# Altium schematic sheet WIZARD_Control.SchDoc
size Letter; SheetNumber: 2; SheetTotal: 2
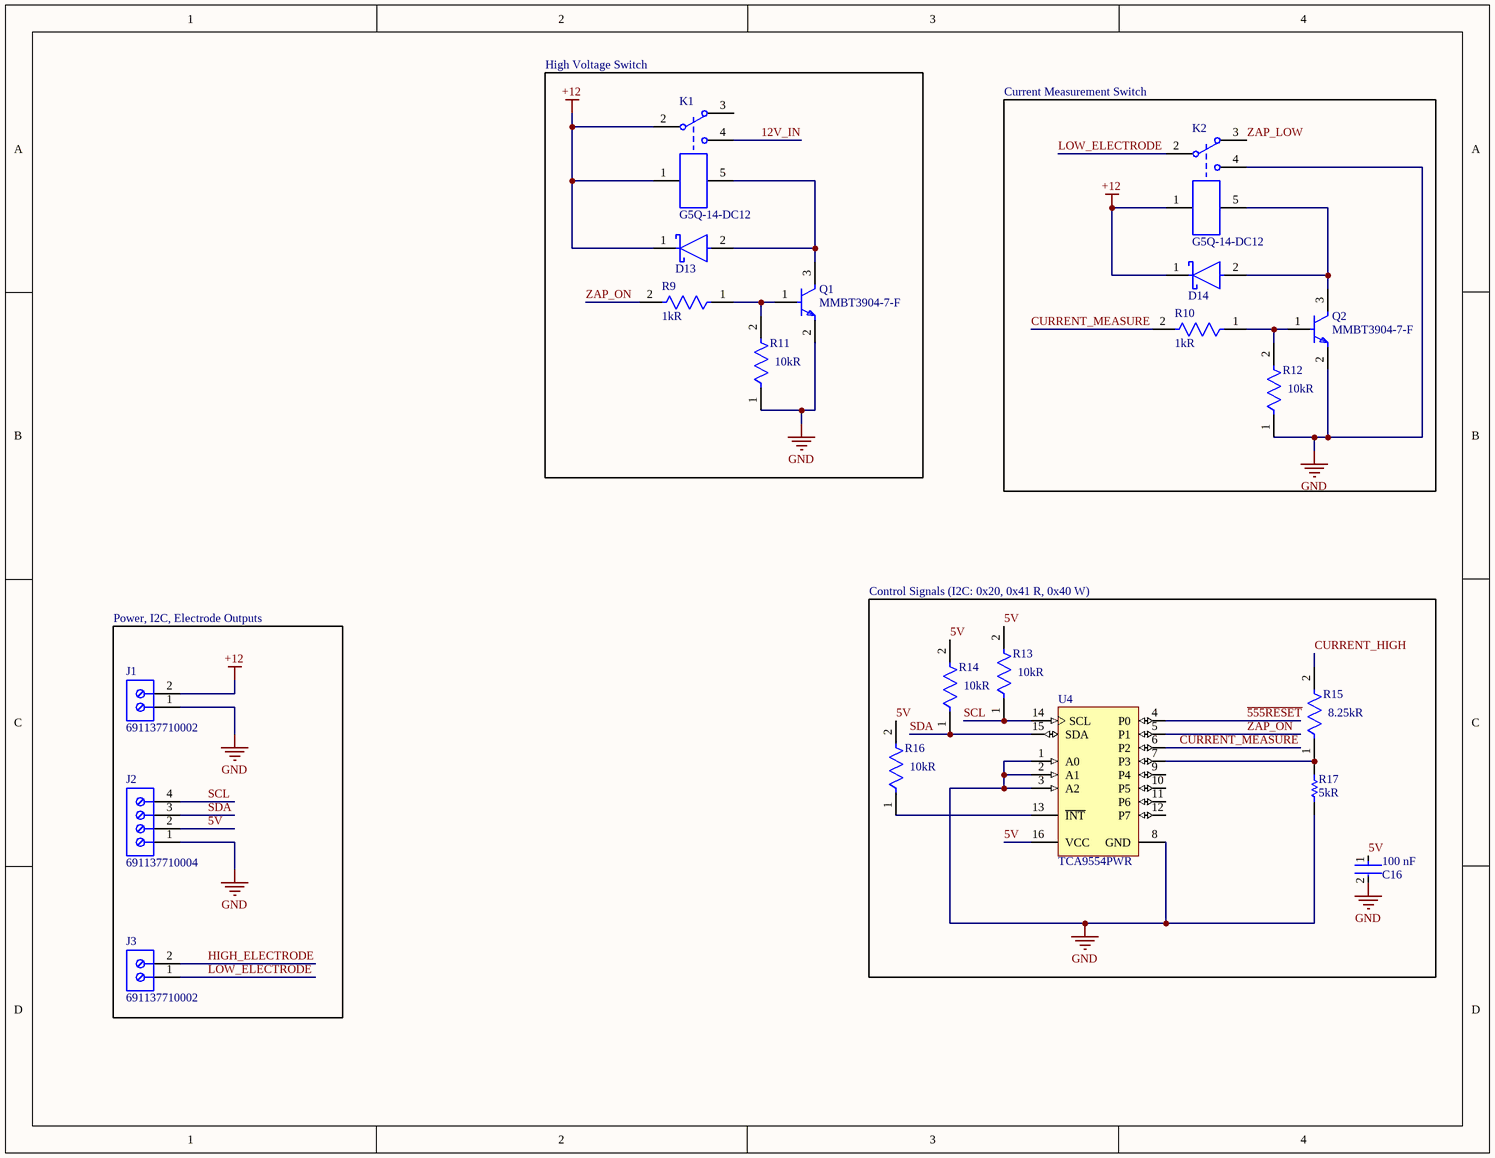
[diagram p0: WIZARD_Control.SchDoc]

## Parts
C16  Capacitance: 100 nF  [FP-CC0805-0_85-MFG]  (hidden comment: CC0805KRX7R9BB104)
D13  SK520B  [FP-SMB-MFG]  (value not drawn)
D14  SK520B  [FP-SMB-MFG]  (value not drawn)
J1  691137710002  [691137710002]
J2  691137710004  [691137710004]
J3  691137710002  [691137710002]
K1  G5Q-14-DC12  [OMRON-G5Q-14-5_V]
K2  G5Q-14-DC12  [OMRON-G5Q-14-5_V]
Q1  MMBT3904-7-F  [FP-SOT23-IPC_A]
Q2  MMBT3904-7-F  [FP-SOT23-IPC_A]
R9  Resistance: 1kR  [FP-RR1220-IPC_A]  (hidden comment: RR1220P-102-D)
R10  Resistance: 1kR  [FP-RR1220-IPC_A]  (hidden comment: RR1220P-102-D)
R11  Resistance: 10kR  [FP-RR1220-IPC_A]  (hidden comment: RR1220P-103-D)
R12  Resistance: 10kR  [FP-RR1220-IPC_A]  (hidden comment: RR1220P-103-D)
R13  Resistance: 10kR  [FP-RR1220-IPC_A]  (hidden comment: RR1220P-103-D)
R14  Resistance: 10kR  [FP-RR1220-IPC_A]  (hidden comment: RR1220P-103-D)
R15  Resistance: 8.25kR  [FP-CRCW0805-e3-IPC_B]  (hidden comment: CRCW08058K25FKEA)
R16  Resistance: 10kR  [FP-RR1220-IPC_A]  (hidden comment: RR1220P-103-D)
R17  value 5kR  [RESC2013X50X30ML20T20]  (hidden comment: CRCW08055K00FKTA)
U4  TCA9554PWR  [PW0016A_M]

## Blocks framed on the sheet
High Voltage Switch: D13 K1 Q1 R9 R11
Current Measurement Switch: D14 K2 Q2 R10 R12
Power, I2C, Electrode Outputs: J1-J3
Control Signals (I2C: 0x20, 0x41 R, 0x40 W): C16 R13-R17 U4

## Nets
+12: D13.1(C) D14.1(C) J1.2 K1.1 K1.2 K2.1
GND: C16.2 J1.1 J2.1 K2.4 Q1.2(E) Q2.2(E) R11.1 R12.1 R17.1 U4.1(A0) U4.2(A1) U4.3(A2) U4.8(GND)
~{555RESET}: U4.4(P0)
5V: C16.1 J2.2 R13.2 R14.2 R16.2 U4.16(VCC)
12V_IN: K1.4
CURRENT_HIGH: R15.2
CURRENT_MEASURE: R10.2 U4.6(P2)
HIGH_ELECTRODE: J3.2
LOW_ELECTRODE: J3.1 K2.2
SCL: J2.4 R13.1 U4.14(SCL)
SDA: J2.3 R14.1 U4.15(SDA)
ZAP_LOW: K2.3
ZAP_ON: R9.2 U4.5(P1)
NetD13_2: D13.2(A) K1.5 Q1.3(C)
NetD14_2: D14.2(A) K2.5 Q2.3(C)
NetQ1_1: Q1.1(B) R9.1 R11.2
NetQ2_1: Q2.1(B) R10.1 R12.2
NetR15_1: R15.1 R17.2 U4.7(P3)
NetR16_1: R16.1 U4.13(~{INT})

Not connected (* = marked no-connect by the designer): K1 3; U4 9(P4) 10(P5) 11(P6) 12(P7)

## Library data of the parts
C16 = CMP-2100-03606-3: CAP CER 0.1UF 50V X7R 0805; Manufacturer: Yageo; Tolerance: 0.1; Value: 100 nF; Material: Ceramic; Device Class L1: Passive Components; ComponentLink2Description: Datasheet; Package: CC0805-0.85; Manufacturer Part Number: CC0805KRX7R9BB104; Digikey Description: CAP CER 0.1UF 50V X7R 0805; Device Class L3: Ceramic Capacitors; Temperature: -30°C to +85°C; Temperature Characteristic: X7R; Voltage Rating: 50 V; Height: 0.95mm; RoHS: TRUE; Ipc Land Pattern Name: CAPC200125X85; Device Class L2: Capacitors; Category: Cap; Temperature Range Low: -30°C; Temperature Range High: +85°C; Mouser Description: Multilayer Ceramic Capacitors MLCC - SMD/SMT 100nF 50V X7R 10%; Footprint Url: http://www.yageo.com/exep/pages/download/literatures/UPY-C_GEN_24.pdf; Automotive: No; Octopart: https://octopart.com/cc0805krx7r9bb104-yageo-192993; Lead Free: Yes; ComponentLink2URL: http://www.yageo.com/documents/recent/UPY-GPHC_Y5V_6.3V-to-50V_8.pdf
D13 D14 = CMP-10078-124483505-1: SK520B Diode Schottky 200V 5A Smb; Peak Reverse Current: 200nA; Capacitance: 140pF; Max Junction Temperature (Tj): 150°C; Max Forward Surge Current (Ifsm): 110A; Max Repetitive Reverse Voltage (Vrrm): 200V; NexarPartId: 124483505; Case/Package: SMB; Forward Current: 5A; Max Operating Temperature: 150°C; Min Operating Temperature: -55°C; Height: 2.6mm; Reverse Voltage: 200V
J1 J3 = CMP-1502-03324-2: NexarPartId: 78871135; Voltage Rating: 300V; Number of Contacts: 2; Current Rating: 16A; Lead Pitch: 5mm; Height: 11.6mm; Packaging: Box; RoHS: Non-Compliant; Contact Material: Nickel, Tin; Max Operating Temperature: 120°C; Number of Pins: 2; Min Operating Temperature: -30°C; Number of Rows: 1
J2 = CMP-1502-03326-2: NexarPartId: 78871140; Packaging: Box; RoHS: Non-Compliant; Number of Pins: 4; Lead Pitch: 5mm
K1 K2 = CMP-2000-06307-2: A Miniature Power Relay with 1-Pole 10 A Switching Capacity, 12 V, 33.3 mA, -40 to 105 degC, 5-Pin THD, RoHS, Bulk; Manufacturer: Omron Electronic Components; PartNumber: G5Q; Coil Resistance: 360Ohm; Coil Voltage: 12V; Coil Current: 33.3mA; Contact Form: SPDT; Power Rating: 0.4W; Manufacturer URL: http://www.omron.com/; Package URL: https://www.omron.com/ecb/products/pdf/en-g5q.pdf; Datasheet URL: https://www.omron.com/ecb/products/pdf/en-g5q.pdf; Contact Material: SilverAlloy; Mounting Style: ThroughHole; Mounting Technology: ThroughHole; Package Description: 5-Pin Through Hole Device, Body 20 x 10 mm; Current Rating: 33.3mA; Package Reference: G5Q-14-5; Datasheet Version: 03/2016
Q1 Q2 = CMP-2000-04931-2: TRANS NPN 40V 0.2A SMD SOT23-3; Frequency: 300MHz; Power Dissipation: 350mW; Element Configuration: Single; Max Power Dissipation: 300mW; Max Collector Current: 200mA; Collector Emitter Saturation Voltage: 300mV; Number of Elements: 1; hFE Min: 100; Collector Base Voltage (VCBO): 60V; Emitter Base Voltage (VEBO): 6V; Contact Plating: Tin; Package Quantity: 3000; Max Frequency: 300MHz; REACH SVHC: No SVHC; Max Operating Temperature: 150°C; Width: 1.4mm; Collector Emitter Voltage (VCEO): 40V; Voltage Rating (DC): 40V; Radiation Hardening: No; Case/Package: SOT-23; Height: 1mm; Collector Emitter Breakdown Voltage: 40V; Length: 3.05mm; Polarity: NPN; Packaging: Tape and Reel; Number of Pins: 3; Min Operating Temperature: -55°C; Gain Bandwidth Product: 300MHz; Mount: Surface Mount; Weight: 0.000282oz; Continuous Collector Current: 200mA; Transition Frequency: 300MHz; Max Breakdown Voltage: 40V; Lead Free: Lead Free
R9 R10 = CMP-2001-03210-2: 1kΩ ±0.5% 0.1W 1/10W Chip Resistor 0805 (2012 Metric) Thin Film; Voltage Rating (DC): 100V; Temperature Coefficient: 25ppm/°C; Power Rating: 100mW; Packaging: Tape and Reel; Max Operating Temperature: 125°C; Resistor Type: Thin Film; Length: 2mm; Number of Terminations: 2; Resistance Tolerance: 0.5%; Termination: SMD/SMT; Height: 0.4mm; Max Power Dissipation: 100mW; Lead Free: Lead Free; Min Operating Temperature: -55°C; Size Code: 0805; Voltage Rating: 100V; Package Quantity: 1; Width: 1.25mm; Depth: 1.25mm; Case/Package: 0805; Case Code (Imperial): 0805; Case Code (Metric): 2012; Tolerance: 0.5%; Series: RR; RoHS Compliant: Yes; Technology: THIN FILM
R11-R14 R16 = CMP-2001-03215-2: 10kΩ ±0.5% 0.1W 1/10W Chip Resistor 0805 (2012 Metric) Thin Film; Max Power Dissipation: 100mW; Voltage Rating: 100V; Temperature Coefficient: 25ppm/°C; Size Code: 0805; RoHS Compliant: Yes; Package Quantity: 1; Resistance Tolerance: 0.5%; Depth: 1.25mm; Lead Free: Lead Free; Series: RR; Min Operating Temperature: -55°C; Weight: 0.000194oz; Width: 1.25mm; Packaging: Tape and Reel; Termination: SMD/SMT; Length: 2mm; Power Rating: 100mW; Case Code (Metric): 2012; Resistor Type: Thin Film; Height: 0.4mm; Case/Package: 0805; Case Code (Imperial): 0805; Technology: THIN FILM; Max Operating Temperature: 125°C; Voltage Rating (DC): 100V; Number of Terminations: 2; Tolerance: 0.5%
R15 = CMP-2001-04150-2: RES Thick Film, 8.25kΩ, 1%, 0.125W, 100ppm/°C, 0805; Max Power Dissipation: 125mW; Voltage Rating: 150V; Resistor Type: Thick Film; Lead Free: Lead Free; Number of Terminations: 2; Temperature Coefficient: 100ppm/°C; Military Standard: Not; Resistance Tolerance: 1%; Min Operating Temperature: -55°C; Tolerance: 1%; Termination: SMD/SMT; Power Rating: 125mW; Height: 0.45mm; Contact Plating: Tin; Length: 2mm; Width: 1.25mm; Max Operating Temperature: 155°C; Technology: THICK FILM; Case/Package: 0805; Features: Automotive AEC-Q200; Weight: 0.000194oz; Construction: Rectangular; RoHS Compliant: Yes; Series: CRCW; Packaging: Tape and Reel; Package Quantity: 5000; Depth: 1.25mm; Voltage Rating (DC): 150V; Size Code: 0805; Case Code (Imperial): 0805; Radiation Hardening: No; Case Code (Metric): 2012
R17 = CMP-2001-04239-1: Manufacturer: Vishay Dale; Part Number: CRCW08055K00FKTA
U4 = CMP-0314-00246-2: Remote 8-Bit I2C and SMBus I/O Expander, 1.65 to 5.5 V, -40 to 85 degC, 16-pin TSSOP (PW), Green (RoHS & no Sb/Br); Manufacturer: Texas Instruments; VCC(Min)(V): 1.65; Configuration Registers: Yes; I2C Address: 0100xxx; # of I/Os: 8; VCC(Max)(V): 5.5; fSCLK(Max)(MHz): 401; Max Frequency(kHz): 400; SubFamily: I2C IO Expander; Interrupt Output: Yes; Code_JEDEC: MO-153; 5V Tolerant I/O: Yes; PackageVersion: revG, Feb-2011; Vcc range(V): 1.65 to 5.5; PartNumber: TCA9554PWR; ComponentLink1URL: http://www.ti.com/general/docs/lit/getliterature.tsp?genericPartNumber=TCA9554&fileType=pdf; Mounting Technology: Surface Mount; ComponentLink1Description: Datasheet; PackageDescription: 16-Pin Plastic Thin Small Outline Package 5 x 4.4 mm Body ,0.65 mm Pitch; Eco-Plan: Green (RoHS & no Sb/Br); PackageReference: PW0016A; Low Power: Yes; DatasheetVersion: SCPS233